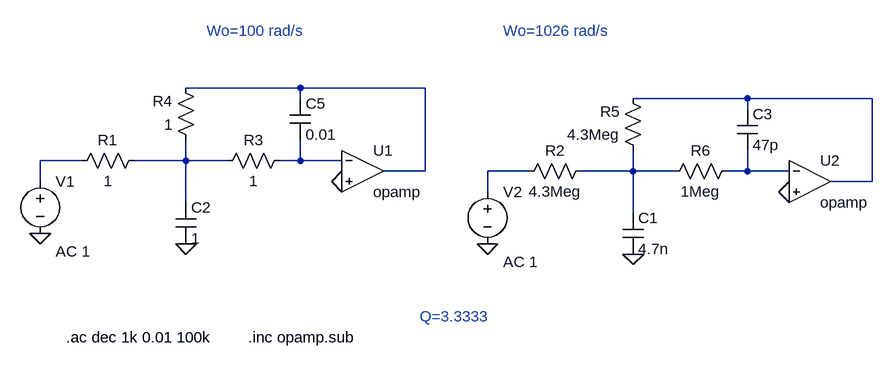
[diagram p0: schematic EJE9.asc]
EJE9.asc, the LTspice schematic file:
Version 4
SHEET 1 1220 680
WIRE 336 64 160 64
WIRE 528 64 336 64
WIRE 336 80 336 64
WIRE 1024 80 848 80
WIRE 1216 80 1024 80
WIRE 1024 96 1024 80
WIRE 0 176 -64 176
WIRE 160 176 160 144
WIRE 160 176 80 176
WIRE 224 176 160 176
WIRE 336 176 336 144
WIRE 336 176 304 176
WIRE 400 176 336 176
WIRE 528 192 528 64
WIRE 528 192 464 192
WIRE 688 192 624 192
WIRE 848 192 848 160
WIRE 848 192 768 192
WIRE 912 192 848 192
WIRE 1024 192 1024 160
WIRE 1024 192 992 192
WIRE 1088 192 1024 192
WIRE -64 208 -64 176
WIRE 1216 208 1216 80
WIRE 1216 208 1152 208
WIRE 624 224 624 192
WIRE 160 240 160 176
WIRE 848 256 848 192
FLAG 160 304 0
FLAG -64 288 0
FLAG 400 208 0
FLAG 848 320 0
FLAG 624 304 0
FLAG 1088 224 0
SYMBOL res 96 160 R90
WINDOW 0 0 56 VBottom 2
WINDOW 3 32 56 VTop 2
SYMATTR InstName R1
SYMATTR Value 1
SYMBOL res 176 160 R180
WINDOW 0 36 76 Left 2
WINDOW 3 36 40 Left 2
SYMATTR InstName R4
SYMATTR Value 1
SYMBOL res 208 192 R270
WINDOW 0 32 56 VTop 2
WINDOW 3 0 56 VBottom 2
SYMATTR InstName R3
SYMATTR Value 1
SYMBOL cap 144 240 R0
SYMATTR InstName C2
SYMATTR Value 1
SYMBOL cap 320 80 R0
SYMATTR InstName C5
SYMATTR Value 0.01
SYMBOL voltage -64 192 R0
WINDOW 123 24 124 Left 2
WINDOW 39 0 0 Left 0
SYMATTR Value2 AC 1
SYMATTR InstName V1
SYMATTR Value ""
SYMBOL OpAmps\\opamp 432 128 R0
SYMATTR InstName U1
SYMBOL res 784 176 R90
WINDOW 0 0 56 VBottom 2
WINDOW 3 32 56 VTop 2
SYMATTR InstName R2
SYMATTR Value 4.3Meg
SYMBOL res 864 176 R180
WINDOW 0 36 76 Left 2
WINDOW 3 36 40 Left 2
SYMATTR InstName R5
SYMATTR Value 4.3Meg
SYMBOL res 896 208 R270
WINDOW 0 32 56 VTop 2
WINDOW 3 0 56 VBottom 2
SYMATTR InstName R6
SYMATTR Value 1Meg
SYMBOL cap 832 256 R0
SYMATTR InstName C1
SYMATTR Value 4.7n
SYMBOL cap 1008 96 R0
SYMATTR InstName C3
SYMATTR Value 47p
SYMBOL voltage 624 208 R0
WINDOW 123 24 124 Left 2
WINDOW 39 0 0 Left 0
SYMATTR Value2 AC 1
SYMATTR InstName V2
SYMATTR Value ""
SYMBOL OpAmps\\opamp 1120 144 R0
SYMATTR InstName U2
TEXT -24 448 Left 2 !.ac dec 1k 0.01 100k
TEXT 256 448 Left 2 !.inc opamp.sub
TEXT 648 -24 Left 2 ;Wo=1026 rad/s
TEXT 520 416 Left 2 ;Q=3.3333
TEXT 192 -24 Left 2 ;Wo=100 rad/s

The netlist it stands for:
* EJE9.asc
R1 N004 N003 1
R4 N004 N001 1
R3 N004 N005 1
C2 N004 0 1
C5 N001 N005 0.01
V1 N003 0 AC 1
XU1 N005 0 N001 opamp Aol=100K GBW=10Meg  ; pins invin noninvin out
R2 N007 N006 4.3Meg
R5 N007 N002 4.3Meg
R6 N007 N008 1Meg
C1 N007 0 4.7n
C3 N002 N008 47p
V2 N006 0 AC 1
XU2 N008 0 N002 opamp Aol=100K GBW=10Meg  ; pins invin noninvin out
.ac dec 1k 0.01 100k
.inc opamp.sub
* Wo=1026 rad/s
* Q=3.3333
* Wo=100 rad/s
.backanno
.end